# EAGLE design final 1 ckt transmitter (EAGLE 8.3.2)
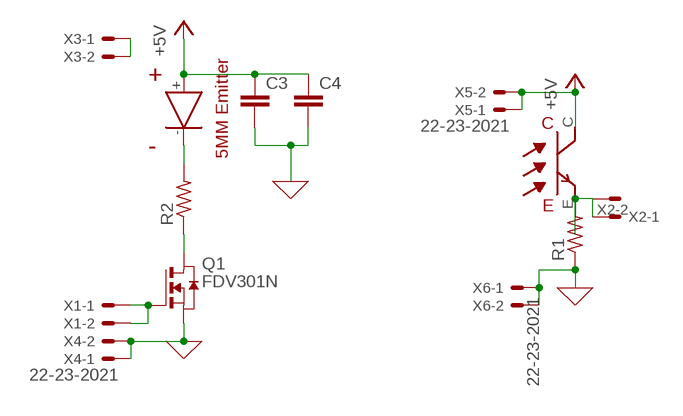
[diagram p0: schematic, sheet 1]

## Parts
C3  CAP0603-CAP  [0603-CAP]
C4  CAP0603-CAP  [0603-CAP]
Q1  FDV301N  [SOT-23]
R1  R-US_R0201  [R0201]
R2  R-US_R0201  [R0201]
U$1  RECEIVER  [RECEIVER]
U$3  EMITTER  [EMITTER]
X1  22-23-2021  [22-23-2021]
X2  22-23-2021  [22-23-2021]
X3  22-23-2021  [22-23-2021]
X4  22-23-2021  [22-23-2021]
X5  22-23-2021  [22-23-2021]
X6  22-23-2021  [22-23-2021]

## Nets
0: C3.2 C4.2 Q1.P$2(S) R1.1 X4.1 X4.2 X6.1 X6.2 ; supply symbol labelled GND
+5V: C3.1 C4.1 U$3.+
N$1: Q1.P$3(D) R2.1
N$2: R1.2 U$1.E X2.1 X2.2
N$3: Q1.P$1(G) X1.1 X1.2
N$4: R2.2 U$3.-
N$5: U$1.C X5.1 X5.2 ; supply symbol labelled +5V
N$6: X3.1 X3.2

## Library data of the parts
C3 C4 = SparkFun:CAP: Capacitor Standard 0603 ceramic capacitor, and 0.1" leaded capacitor.
Q1 = FDV301N:FDV301N: Digital FET, N-Channel This device has been designed especially for low voltage applications as a replacement for digital transistors. 25 V, 0.22 A continuous. 0.5 A peak Rds(on) < 5R @ Vgs 2.7 V. Datasheet <http://datasheet.octopart.com/FDV301N-Fairchild-datasheet-8330556.pdf>; AVAILABILITY: Unavailable; DESCRIPTION: Trans MOSFET N-CH 25V 0.5A 3-Pin SOT-23 T/R; MF: ON Semiconductor; MP: FDV301N; PACKAGE: SOT-23-3 ON Semiconductor; PRICE: None
R1 R2 = rcl:R-US_: RESISTOR, American symbol; SPICEPREFIX: R
U$1 = sfh4550 & teft4300:RECEIVER
U$3 = sfh4550 & teft4300:EMITTER
X1-X6 = con-molex:22-23-2021: .100" (2.54mm) Center Header - 2 Pin; MF: MOLEX; MPN: 22-23-2021; OC_FARNELL: 1462926; OC_NEWARK: 25C3832

## Net classes
0 default: width 0.305 mm, drill 0.508 mm, clearance 0.254 mm

## Board
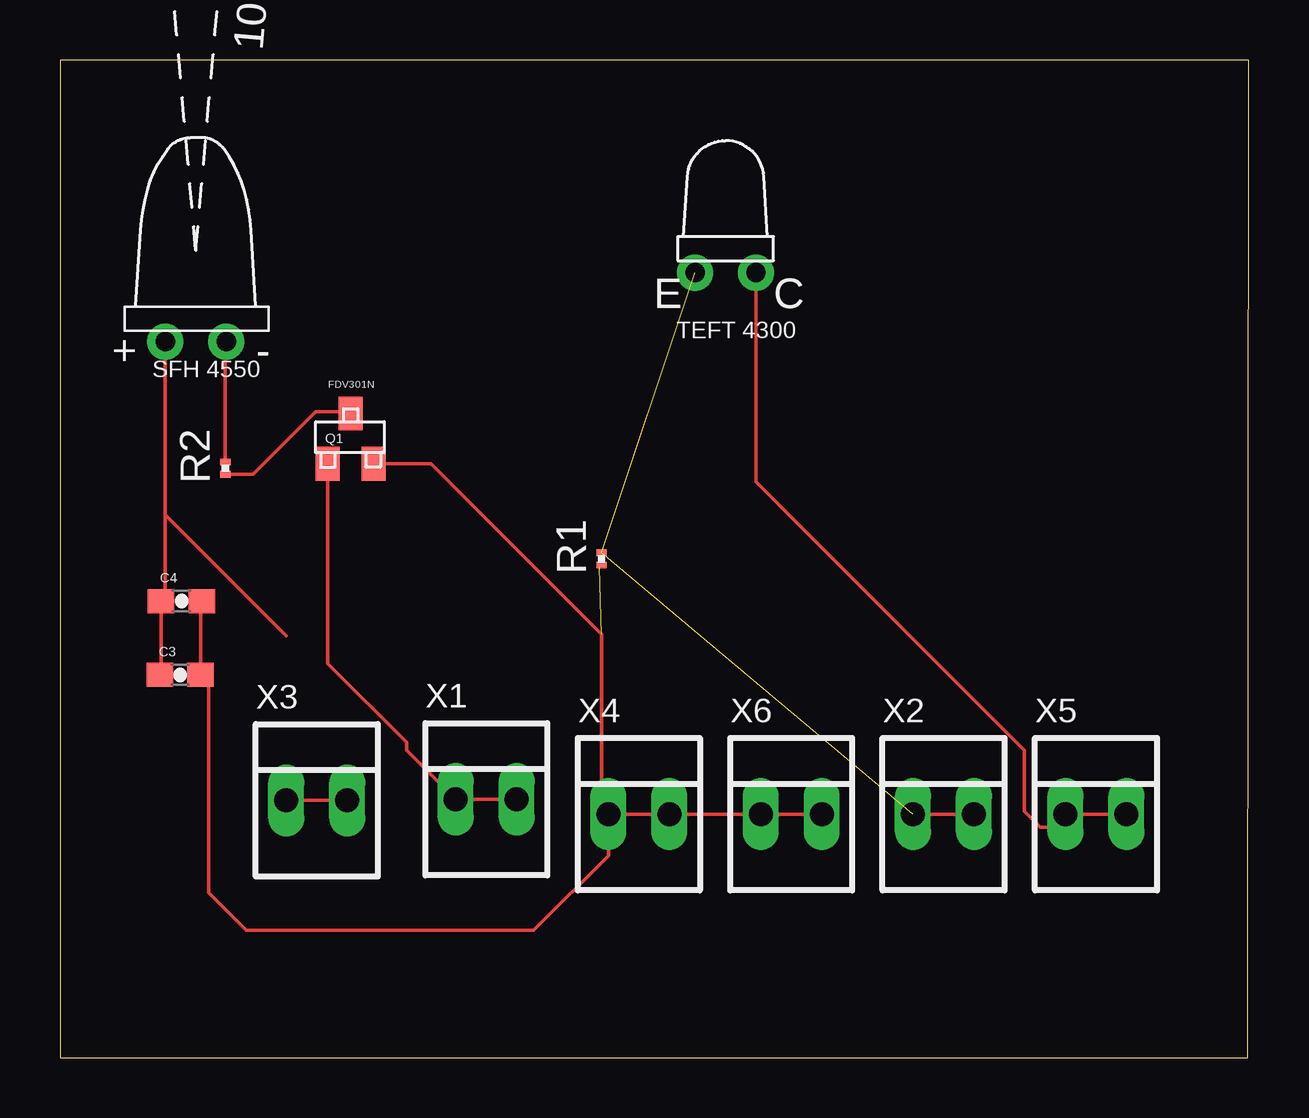
[diagram p1: board, top side]

Size 49.55 x 41.58 mm. Coordinates in mm from the lower left corner, seen from the top.
Outline: 0,0 49.51,0 49.55,41.58 0,41.58 0,0
Copper layers (1*16): Top 0.035mm / dielectric 1.5mm / Bottom 0.035mm
Design rules "default": minimum track width 6mil, minimum drill 0.35mm, track to track 6mil, track to pad 6mil, pad to pad 6mil, via to via 6mil, smd to smd 6mil, copper to edge 40mil, drill to drill 6mil, minimum pad ring 10mil, minimum via ring 8mil, stop-mask expansion 4mil, vias tented up to drill 0mil, thermal gap 10mil

### Footprints (pad centres in the part's own frame; a part is rotated, then mirrored left to right if it is on the bottom)
0603-CAP = smd 1.1 x 1: 1 -0.85,0; 2 0.85,0
SOT-23 = smd 1 x 1.4: P$1 -0.95,-1.1; P$2 0.95,-1.1; P$3 0,1
R0201 = smd 0.28 x 0.43: 1 -0.255,0; 2 0.255,0
RECEIVER = drill 0.8 pad 1.5: C 1.27,-0.5; E -1.27,-0.5
EMITTER = drill 0.8 pad 1.5: + -1.27,-0.5; - 1.27,-0.5
22-23-2021 = drill 1 long: 1 -1.27,0; 2 1.27,0

### Placement (x,y rotation side)
C3  5.01,15.96 0 top
C4  5.06,19.04 0 top
Q1  12.11,25.86 0 top
R1  22.58,20.79 90 top
R2  6.89,24.57 90 top
U$1  27.75,33.22 0 top
U$3  5.66,30.35 0 top
X1  17.77,10.78 0 top
X2  36.83,10.16 0 top
X3  10.71,10.73 0 top
X4  24.13,10.16 0 top
X5  43.18,10.16 0 top
X6  30.48,10.16 0 top

### Tracks (layer width: path | path; a pad name or v marks a point on that pad's centre or on a via)
0  (1 unrouted)
  Top 0.152: C4.2 5.86,18.98 C3.2 6.21,15.61 6.21,6.88 7.77,5.32 19.75,5.32 22.86,8.43 X4.1 | Q1.P$2 15.46,24.76 22.58,17.64 22.58,10.44 X4.1 | 22.49,20.45 R1.1 | X4.1 X4.2 X6.1 X6.2
+5V
  Top 0.152: 4.39,22.64 U$3.+ | 4.39,22.64 4.39,19.22 C4.1 4.21,16.01 C3.1 | 9.44,17.59 4.39,22.64
N$1
  Top 0.152: R2.1 8.04,24.32 10.65,26.92 12.05,26.92 Q1.P$3
N$2  (2 unrouted)
  Top 0.152: X2.2 X2.1
N$3
  Top 0.152: Q1.P$1 11.16,16.43 14.45,13.15 14.45,12.83 X1.1 X1.2
N$4
  Top 0.152: R2.2 6.89,29.81 U$3.-
N$5
  Top 0.152: U$1.C 29.02,24.01 40.2,12.83 40.2,10.27 40.86,9.62 41.37,9.62 X5.1 X5.2
N$6
  Top 0.152: X3.1 X3.2